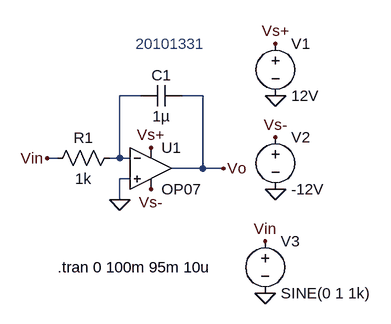
[diagram p0: schematic Integrator.asc]
Integrator.asc, the LTspice schematic file:
Version 4
SHEET 1 880 680
WIRE 176 48 144 48
WIRE 272 48 240 48
WIRE 48 144 32 144
WIRE 144 144 144 48
WIRE 144 144 128 144
WIRE 160 144 144 144
WIRE 272 160 272 48
WIRE 272 160 224 160
WIRE 304 160 272 160
WIRE 160 176 144 176
WIRE 144 208 144 176
FLAG 384 48 0
FLAG 384 192 0
FLAG 368 352 0
FLAG 144 208 0
FLAG 384 -32 Vs+
FLAG 384 112 Vs-
FLAG 368 272 Vin
FLAG 32 144 Vin
FLAG 304 160 Vo
FLAG 192 128 Vs+
FLAG 192 192 Vs-
SYMBOL OpAmps\\OP07 192 96 R0
SYMATTR InstName U1
SYMBOL res 144 128 R90
WINDOW 0 0 56 VBottom 2
WINDOW 3 32 56 VTop 2
SYMATTR InstName R1
SYMATTR Value 1k
SYMBOL cap 240 32 R90
WINDOW 0 0 32 VBottom 2
WINDOW 3 32 32 VTop 2
SYMATTR InstName C1
SYMATTR Value 1µ
SYMBOL voltage 384 -48 R0
SYMATTR InstName V1
SYMATTR Value 12V
SYMBOL voltage 384 96 R0
SYMATTR InstName V2
SYMATTR Value -12V
SYMBOL voltage 368 256 R0
WINDOW 123 0 0 Left 0
WINDOW 39 0 0 Left 0
SYMATTR InstName V3
SYMATTR Value SINE(0 1 1k)
TEXT 168 -32 Left 2 ;20101331
TEXT 48 312 Left 2 !.tran 0 100m 95m 10u

The netlist it stands for:
* Integrator.asc
XU1 0 N001 Vs+ Vs- Vo LT1001  ; OP07, pins In+ In- V+ V- OUT
R1 N001 Vin 1k
C1 Vo N001 1µ
V1 Vs+ 0 12V
V2 Vs- 0 -12V
V3 Vin 0 SINE(0 1 1k)
* 20101331
.tran 0 100m 95m 10u
.lib LTC.lib
.backanno
.end